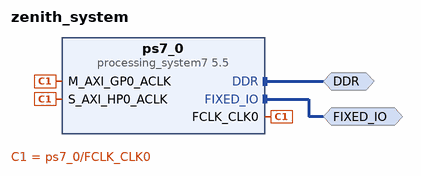
[diagram p0: block diagram of the top level]
# Vivado block design zenith_system, xc7z020clg400-1, Vivado 2025.2
create_bd_design zenith_system

create_bd_intf_port -mode Master -vlnv xilinx.com:interface:ddrx_rtl:1.0 DDR
create_bd_intf_port -mode Master -vlnv xilinx.com:display_processing_system7:fixedio_rtl:1.0 FIXED_IO

create_bd_cell -type ip -vlnv xilinx.com:ip:processing_system7:5.5 ps7_0
set_property -dict {CONFIG.PCW_FPGA0_PERIPHERAL_FREQMHZ 150 CONFIG.PCW_USE_S_AXI_HP0 1} [get_bd_cells ps7_0]
# 30 more settings of ps7_0 are not shown: defaults, MIO pin electricals, DDR timing, and values the tool derives

# ---- connections ----

connect_bd_intf_net [get_bd_intf_ports DDR] [get_bd_intf_pins ps7_0/DDR]
connect_bd_intf_net [get_bd_intf_ports FIXED_IO] [get_bd_intf_pins ps7_0/FIXED_IO]
connect_bd_net [get_bd_pins ps7_0/FCLK_CLK0] [get_bd_pins ps7_0/M_AXI_GP0_ACLK] [get_bd_pins ps7_0/S_AXI_HP0_ACLK]

validate_bd_design
save_bd_design
